# EAGLE schematic mcu_block (EAGLE 6.5.0)
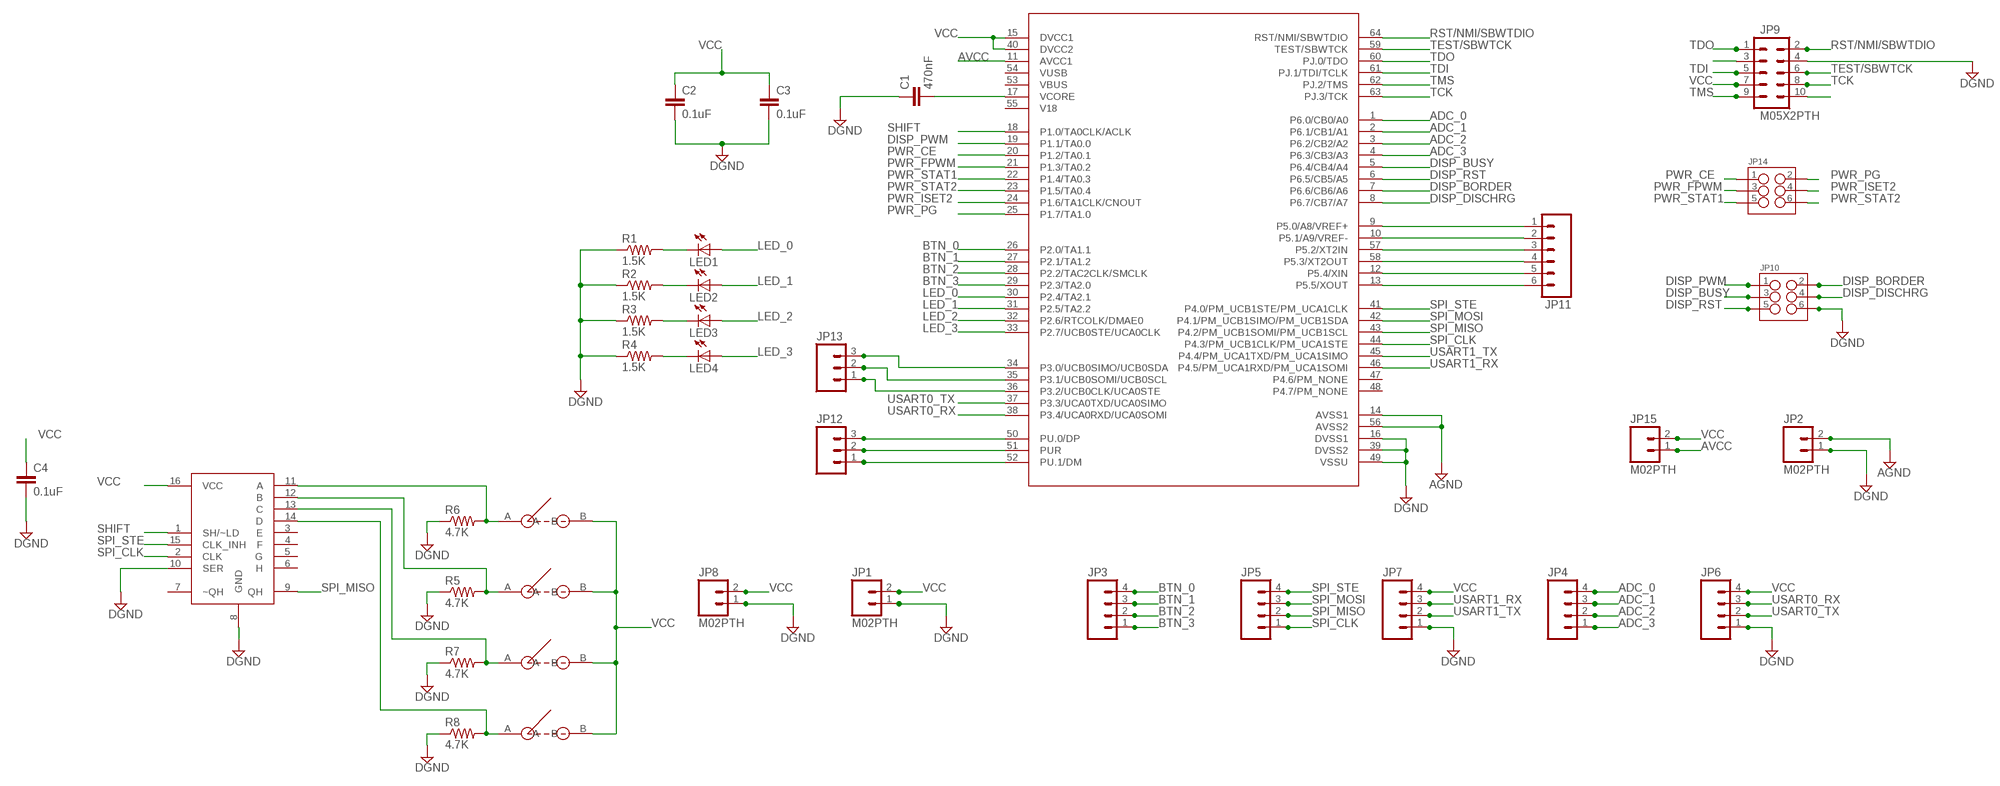
[diagram p0: schematic, sheet 1]

## Parts
C1  470nF  CAP0603-CAP  [0603-CAP]
C2  0.1uF  CAP0603-CAP  [0603-CAP]
C3  0.1uF  CAP0603-CAP  [0603-CAP]
C4  0.1uF  CAP0603-CAP  [0603-CAP]
JP1  M02PTH  [1X02]
JP2  M02PTH  [1X02]
JP3  M04LOCK  [1X04_LOCK]
JP4  M04LOCK  [1X04_LOCK]
JP5  M04LOCK  [1X04_LOCK]
JP6  M04LOCK  [1X04_LOCK]
JP7  M04LOCK  [1X04_LOCK]
JP8  M02PTH  [1X02]
JP9  M05X2PTH  [AVR_ICSP]
JP10  M03X2POGO_PINS  [2X3_POGO]
JP11  M06SIP  [1X06]
JP12  M03PTH  [1X03]
JP13  M03PTH  [1X03]
JP14  M03X2POGO_PINS  [2X3_POGO]
JP15  M02PTH  [1X02]
LED1  LED0603  [LED-0603]
LED2  LED0603  [LED-0603]
LED3  LED0603  [LED-0603]
LED4  LED0603  [LED-0603]
R1  1.5K  RESISTOR0603-RES  [0603-RES]
R2  1.5K  RESISTOR0603-RES  [0603-RES]
R3  1.5K  RESISTOR0603-RES  [0603-RES]
R4  1.5K  RESISTOR0603-RES  [0603-RES]
R5  4.7K  RESISTOR0603-RES  [0603-RES]
R6  4.7K  RESISTOR0603-RES  [0603-RES]
R7  4.7K  RESISTOR0603-RES  [0603-RES]
R8  4.7K  RESISTOR0603-RES  [0603-RES]
U$1  MSP430F5528  [VQFN_RGC_64PIN]
U$2  EVQ_TAC_BUTTONS  [EVQ-PF_BUTTONS]
U$3  EVQ_TAC_BUTTONS  [EVQ-PF_BUTTONS]
U$4  EVQ_TAC_BUTTONS  [EVQ-PF_BUTTONS]
U$5  EVQ_TAC_BUTTONS  [EVQ-PF_BUTTONS]
U$6  8B_SHIFT_REG  [TSSOP16]

## Nets
ADC_0: JP4.4 U$1.1(P6.0/CB0/A0)
ADC_1: JP4.3 U$1.2(P6.1/CB1/A1)
ADC_2: JP4.2 U$1.3(P6.2/CB2/A2)
ADC_3: JP4.1 U$1.4(P6.3/CB3/A3)
AGND: JP2.2 U$1.14(AVSS1) U$1.56(AVSS2)
AVCC: JP15.1 U$1.11(AVCC1)
BTN_0: JP3.4 U$1.26(P2.0/TA1.1)
BTN_1: JP3.3 U$1.27(P2.1/TA1.2)
BTN_2: JP3.2 U$1.28(P2.2/TAC2CLK/SMCLK)
BTN_3: JP3.1 U$1.29(P2.3/TA2.0)
DGND: C1.1 C2.2 C3.2 C4.2 JP1.1 JP2.1 JP6.1 JP7.1 JP8.1 JP9.4 JP10.P$6 R1.1 R2.1 R3.1 R4.1 R5.1 R6.1 R7.1 R8.1 U$1.16(DVSS1) U$1.39(DVSS2) U$1.49(VSSU) U$6.8(GND) U$6.10(SER)
DISP_BORDER: JP10.P$2 U$1.7(P6.6/CB6/A6)
DISP_BUSY: JP10.P$3 U$1.5(P6.4/CB4/A4)
DISP_DISCHRG: JP10.P$4 U$1.8(P6.7/CB7/A7)
DISP_PWM: JP10.P$1 U$1.19(P1.1/TA0.0)
DISP_RST: JP10.P$5 U$1.6(P6.5/CB5/A5)
LED_0: LED1.A U$1.30(P2.4/TA2.1)
LED_1: LED2.A U$1.31(P2.5/TA2.2)
LED_2: LED3.A U$1.32(P2.6/RTCOLK/DMAE0)
LED_3: LED4.A U$1.33(P2.7/UCB0STE/UCA0CLK)
N$1: C1.2 U$1.17(VCORE)
N$2: LED4.C R4.2
N$3: JP9.3
N$4: JP11.1 U$1.9(P5.0/A8/VREF+)
N$5: JP11.2 U$1.10(P5.1/A9/VREF-)
N$6: JP11.3 U$1.57(P5.2/XT2IN)
N$7: JP11.4 U$1.58(P5.3/XT2OUT)
N$8: JP11.5 U$1.12(P5.4/XIN)
N$9: JP11.6 U$1.13(P5.5/XOUT)
N$10: JP12.3 U$1.50(PU.0/DP)
N$11: JP9.10
N$12: JP12.2 U$1.51(PUR)
N$13: JP12.1 U$1.52(PU.1/DM)
N$14: JP13.1 U$1.36(P3.2/UCB0CLK/UCA0STE)
N$15: JP13.2 U$1.35(P3.1/UCB0SOMI/UCB0SCL)
N$16: JP13.3 U$1.34(P3.0/UCB0SIMO/UCB0SDA)
N$17: LED3.C R3.2
N$18: LED2.C R2.2
N$19: LED1.C R1.2
N$20: R6.2 U$5.A U$6.11(A)
N$22: R5.2 U$2.A U$6.12(B)
N$24: R7.2 U$3.A U$6.13(C)
N$26: R8.2 U$4.A U$6.14(D)
PWR_CE: JP14.P$1 U$1.20(P1.2/TA0.1)
PWR_FPWM: JP14.P$3 U$1.21(P1.3/TA0.2)
PWR_ISET2: JP14.P$4 U$1.24(P1.6/TA1CLK/CNOUT)
PWR_PG: JP14.P$2 U$1.25(P1.7/TA1.0)
PWR_STAT1: JP14.P$5 U$1.22(P1.4/TA0.3)
PWR_STAT2: JP14.P$6 U$1.23(P1.5/TA0.4)
RST/NMI/SBWTDIO: JP9.2 U$1.64(RST/NMI/SBWTDIO)
SHIFT: U$1.18(P1.0/TA0CLK/ACLK) U$6.1(SH/~LD)
SPI_CLK: JP5.1 U$1.44(P4.3/PM_UCB1CLK/PM_UCA1STE) U$6.2(CLK)
SPI_MISO: JP5.2 U$1.43(P4.2/PM_UCB1SOMI/PM_UCB1SCL) U$6.9(QH)
SPI_MOSI: JP5.3 U$1.42(P4.1/PM_UCB1SIMO/PM_UCB1SDA)
SPI_STE: JP5.4 U$1.41(P4.0/PM_UCB1STE/PM_UCA1CLK) U$6.15(CLK_INH)
TCK: JP9.8 U$1.63(PJ.3/TCK)
TDI: JP9.5 U$1.61(PJ.1/TDI/TCLK)
TDO: JP9.1 U$1.60(PJ.0/TDO)
TEST/SBWTCK: JP9.6 U$1.59(TEST/SBWTCK)
TMS: JP9.9 U$1.62(PJ.2/TMS)
USART0_RX: JP6.3 U$1.38(P3.4/UCA0RXD/UCA0SOMI)
USART0_TX: JP6.2 U$1.37(P3.3/UCA0TXD/UCA0SIMO)
USART1_RX: JP7.3 U$1.46(P4.5/PM_UCA1RXD/PM_UCA1SOMI)
USART1_TX: JP7.2 U$1.45(P4.4/PM_UCA1TXD/PM_UCA1SIMO)
VCC: C2.1 C3.1 C4.1 JP1.2 JP6.4 JP7.4 JP8.2 JP9.7 JP15.2 U$1.15(DVCC1) U$1.40(DVCC2) U$2.B U$3.B U$4.B U$5.B U$6.16(VCC)
Unconnected: U$1.47(P4.6/PM_NONE) U$1.48(P4.7/PM_NONE) U$1.53(VBUS) U$1.54(VUSB) U$1.55(V18) U$6.3(E) U$6.4(F) U$6.5(G) U$6.6(H) U$6.7(~QH)

## Library data of the parts
C1-C4 = SparkFun-Capacitors:CAP: Capacitor Standard 0603 ceramic capacitor, and 0.1" leaded capacitor.
JP1 JP2 JP8 JP15 = SparkFun-Connectors:M02: Standard 2-pin 0.1" header. Use with - straight break away headers ( PRT-00116) - right angle break away headers (PRT-00553) - swiss pins (PRT-00743) - machine pins (PRT-00117) - female headers (PRT-00115) Molex polarized connector foot print use with: PRT-08233 with associated crimp pins and housings. 2.54_SCREWTERM for use with PRT-10571. 3.5mm Screw Terminal footprints for PRT-08084 5mm Screw Terminal footprints for use with PRT-08433
JP3-JP7 = SparkFun-Connectors:M04: Header 4 Standard 4-pin 0.1" header. Use with straight break away headers (SKU : PRT-00116), right angle break away headers (PRT-00553), swiss pins (PRT-00743), machine pins (PRT-00117), and female headers (PRT-00115). Molex polarized connector foot print use with SKU : PRT-08231 with associated crimp pins and housings. 1MM SMD Version SKU: PRT-10208
JP9 = SparkFun-Connectors:M05X2: Header 5x2 Standard 10-pin dual row 0.1" header. Commonly used with AVR-ISP. Use with Spark Fun Electronics SKU: PRT-00778
JP10 JP14 = SparkFun-Connectors:M03X2: 2x3 .1" header. Shrouded, with keying- CONN-10681 SMT- CONN-11415 Pogo pins- HW-11044; PROD_ID: HW-11044
JP11 = SparkFun-Connectors:M06: Header 6 Standard 6-pin 0.1" header. Use with straight break away headers (SKU : PRT-00116), right angle break away headers (PRT-00553), swiss pins (PRT-00743), machine pins (PRT-00117), and female headers (PRT-00115). Molex polarized connector foot print use with SKU : PRT-08094 with associated crimp pins and housings. NOTES ON THE VARIANTS LOCK and LOCK_LONGPADS... This footprint was designed to help hold the alignment of a through-hole component (i.e. 6-pin header) while soldering it into place. You may notice that each hole has been shifted either up or down by 0.005 of an inch from it's more standard position (which is a perfectly straight line). This slight alteration caused the pins (the squares in the middle) to touch the edges of the holes. Because they are alternating, it causes a "brace" to hold the component in place. 0.005 has proven to be the perfect amount of "off-center" position when using our standard breakaway headers. Although looks a little odd when you look at the bare footprint, once you have a header in there, the alteration is very hard to notice. Also,if you push a header all the way into place, it is covered up entirely on the bottom side. This idea of altering the position of holes to aid alignment will be further integrated into the Sparkfun Library for other footprints. It can help hold any component with 3 or more connection pins.
JP12 JP13 = SparkFun-Connectors:M03: Header 3 Standard 3-pin 0.1" header. Use with straight break away headers (SKU : PRT-00116), right angle break away headers (PRT-00553), swiss pins (PRT-00743), machine pins (PRT-00117), and female headers (PRT-00115). Molex polarized connector foot print use with SKU : PRT-08232 with associated crimp pins and housings.
LED1-LED4 = SparkFun-LED:LED: LEDs Standard schematic elements and footprints for 5mm, 3mm, 1206, and 0603 sized LEDs. 5mm - Spark Fun Electronics SKU : COM-00529 (and others)
R1-R8 = SparkFun-Passives:RESISTOR: Resistor Basic schematic elements and footprints for 0603, 1206, and PTH resistors.
U$1 = TuansLib:MSP430F5528
U$2-U$5 = TuansLib:EVQ_TAC_BUTTONS
U$6 = TuansLib:8B_SHIFT_REG